# Altium schematic sheet PCM2706 Bus Powered USB DAC 3.SchDoc
size A3
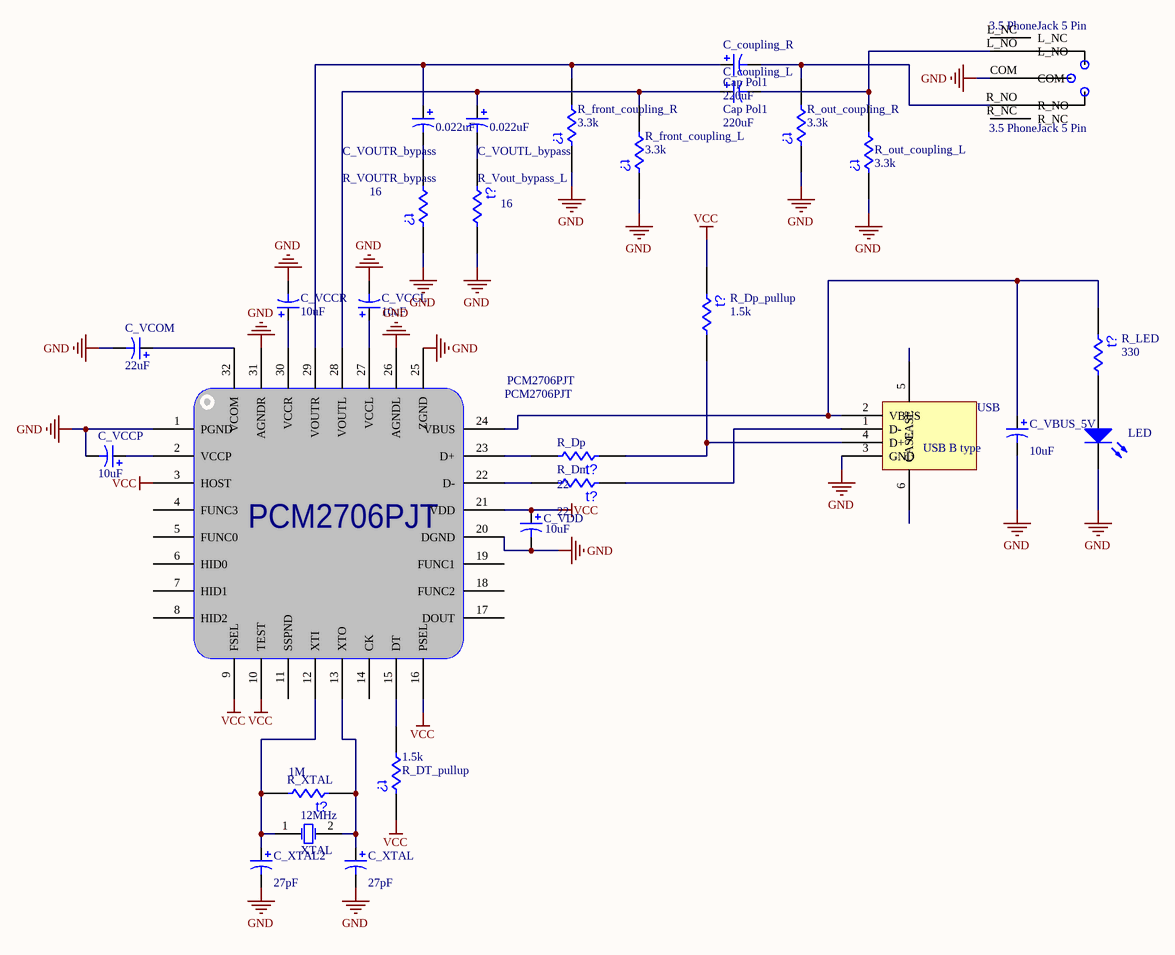
[diagram p0: PCM2706 Bus Powered USB DAC 3.SchDoc]

## Parts
1.5k  R_DT_pullup  [6-0805_N]
3.5_PhoneJack_5_Pin  3.5 PhoneJack 5 Pin  [3.5 PhoneJack 5 Pin]
12MHz  XTAL  [12MHz Crystal OSC through hole]
C_coupling_L  Cap Pol1  value 220uF  [RB5-10.5_narrowed]
C_coupling_R  Cap Pol1  value 220uF  [RB5-10.5_narrowed]
C_VBUS_5V  value 10uF  [C0805]
C_VCCL  value 10uF  [C0805]
C_VCCP  value 10uF  [C0805]
C_VCCR  value 10uF  [C0805]
C_VCOM  value 22uF  [Tantalum 6032-28 case C kemet]
C_VDD  value 10uF  [C0805]
C_VOUTL_bypass  value 0.022uF  [C0805]
C_VOUTR_bypass  value 0.022uF  [C0805]
C_XTAL  value 27pF  [C0805]
C_XTAL2  value 27pF  [C0805]
LED  (no value)  [6-0805_N_enlarge]
PCM2706PJT  PCM2706PJT  [S-PQFP-N32-2mm-out]
R_Dm  22  [6-0805_N]
R_Dp  22  [6-0805_N]
R_Dp_pullup  1.5k  [6-0805_N]
R_front_coupling_L  3.3k  [6-0805_N]
R_front_coupling_R  3.3k  [6-0805_N]
R_LED  330  [6-0805_N]
R_out_coupling_L  3.3k  [6-0805_N]
R_out_coupling_R  3.3k  [6-0805_N]
R_Vout_bypass_L  16  [6-0805_N]
R_VOUTR_bypass  16  [6-0805_N]
R_XTAL  1M  [6-0805_N]
USB  USB B type  [USB2.5-2H4D]

## Nets
GND: 3.5_PhoneJack_5_Pin.COM C_VBUS_5V.2 C_VCCL.2 C_VCCP.2 C_VCCR.2 C_VCOM.2 C_VDD.2 C_XTAL.2 C_XTAL2.2 LED.2(K) PCM2706PJT.1(PGND) PCM2706PJT.20(DGND) PCM2706PJT.25(ZGND) PCM2706PJT.26(AGNDL) PCM2706PJT.31(AGNDR) R_front_coupling_L.1 R_front_coupling_R.1 R_out_coupling_L.1 R_out_coupling_R.1 R_Vout_bypass_L.2 R_VOUTR_bypass.1 USB.3(GND)
VCC: 1.5k.1 C_VDD.1 PCM2706PJT.3(HOST) PCM2706PJT.9(FSEL) PCM2706PJT.10(TEST) PCM2706PJT.16(PSEL) PCM2706PJT.21(VDD) R_Dp_pullup.1
Net1.5k_2: 1.5k.2 PCM2706PJT.15(DT)
Net3.5_PhoneJack_5_Pin_L_NO: 3.5_PhoneJack_5_Pin.L_NO C_coupling_L.2 R_out_coupling_L.2
Net3.5_PhoneJack_5_Pin_R_NO: 3.5_PhoneJack_5_Pin.R_NO C_coupling_R.2 R_out_coupling_R.2
Net12MHz_1: 12MHz.1(OSC1) C_XTAL2.1 PCM2706PJT.12(XTI) R_XTAL.2
Net12MHz_2: 12MHz.2(OSC2) C_XTAL.1 PCM2706PJT.13(XTO) R_XTAL.1
NetC_coupling_L_1: C_coupling_L.1 C_VOUTL_bypass.1 PCM2706PJT.28(VOUTL) R_front_coupling_L.2
NetC_coupling_R_1: C_coupling_R.1 C_VOUTR_bypass.1 PCM2706PJT.29(VOUTR) R_front_coupling_R.2
NetC_VBUS_5V_1: C_VBUS_5V.1 PCM2706PJT.24(VBUS) R_LED.1 USB.2(VBUS)
NetC_VCCL_1: C_VCCL.1 PCM2706PJT.27(VCCL)
NetC_VCCP_1: C_VCCP.1 PCM2706PJT.2(VCCP)
NetC_VCCR_1: C_VCCR.1 PCM2706PJT.30(VCCR)
NetC_VCOM_1: C_VCOM.1 PCM2706PJT.32(VCOM)
NetC_VOUTL_bypass_2: C_VOUTL_bypass.2 R_Vout_bypass_L.1
NetC_VOUTR_bypass_2: C_VOUTR_bypass.2 R_VOUTR_bypass.2
NetLED_1: LED.1(A) R_LED.2
NetPCM2706PJT_22: PCM2706PJT.22(D-) R_Dm.2
NetPCM2706PJT_23: PCM2706PJT.23(D+) R_Dp.2
NetR_Dm_1: R_Dm.1 USB.1(D-)
NetR_Dp_1: R_Dp.1 R_Dp_pullup.2 USB.4(D+)

Not connected (* = marked no-connect by the designer): 3.5_PhoneJack_5_Pin L_NC R_NC; PCM2706PJT 4(FUNC3) 5(FUNC0) 6(HID0) 7(HID1) 8(HID2) 11(SSPND) 14(CK) 17(DOUT) 18(FUNC2) 19(FUNC1); USB 5(CASE) 6(CASE)

## Notes on the sheet
- (in symbol Res Thermal) t?

## Library data of the parts
1.5k R_Dm R_Dp R_Dp_pullup R_front_coupling_L R_front_coupling_R R_LED R_out_coupling_L R_out_coupling_R R_Vout_bypass_L R_VOUTR_bypass R_XTAL = Res Thermal: Thermistor; Published: 24-Mar-1999; LatestRevisionDate: 29-May-2009; LatestRevisionNote: IPC-7351 Footprint Added.; PackageVersion: Mar-2003; PackageReference: 6-0805; Publisher: Altium Limited; PackageDescription: Chip Resistor 0805 Case Size; Code_IPC: RESC2012
12MHz = XTAL: Crystal Oscillator; Published: 8-Jun-2000; LatestRevisionDate: 17-Jul-2002; LatestRevisionNote: Re-released for DXP Platform.; PackageReference: R38; Publisher: Altium Limited; PackageDescription: Crystal, Thru-Hole; 2 Leads; Body 3.1 x 8.2 mm (Dia.xH)
C_coupling_L C_coupling_R = Cap Pol1: Polarized Capacitor (Radial); Published: 8-Jun-2000; LatestRevisionDate: 17-Jul-2002; LatestRevisionNote: Re-released for DXP Platform.; PackageReference: RB7.6-15; Publisher: Altium Limited; PackageDescription: Polarized Capacitor (Radial); 2 Leads
C_VBUS_5V C_VCCL C_VCCP C_VCCR C_VCOM C_VDD C_VOUTL_bypass C_VOUTR_bypass C_XTAL C_XTAL2 = Cap Pol3: Polarized Capacitor (Surface Mount); Published: 8-Jun-2000; LatestRevisionDate: 29-May-2009; LatestRevisionNote: IPC-7351 Footprint Added.; PackageReference: C0805; Publisher: Altium Limited; PackageDescription: Chip Capacitor
LED = LED2: Typical RED, GREEN, YELLOW, AMBER GaAs LED; Published: 8-Jun-2000; LatestRevisionDate: 17-Jul-2002; LatestRevisionNote: Re-released for DXP Platform.; PackageVersion: Feb-2002; PackageReference: 3.2X1.6X1.1; Publisher: Altium Limited; PackageDescription: SM LED; 2 Flat Leads